# EAGLE design TriacFanout (EAGLE 6.5.0)
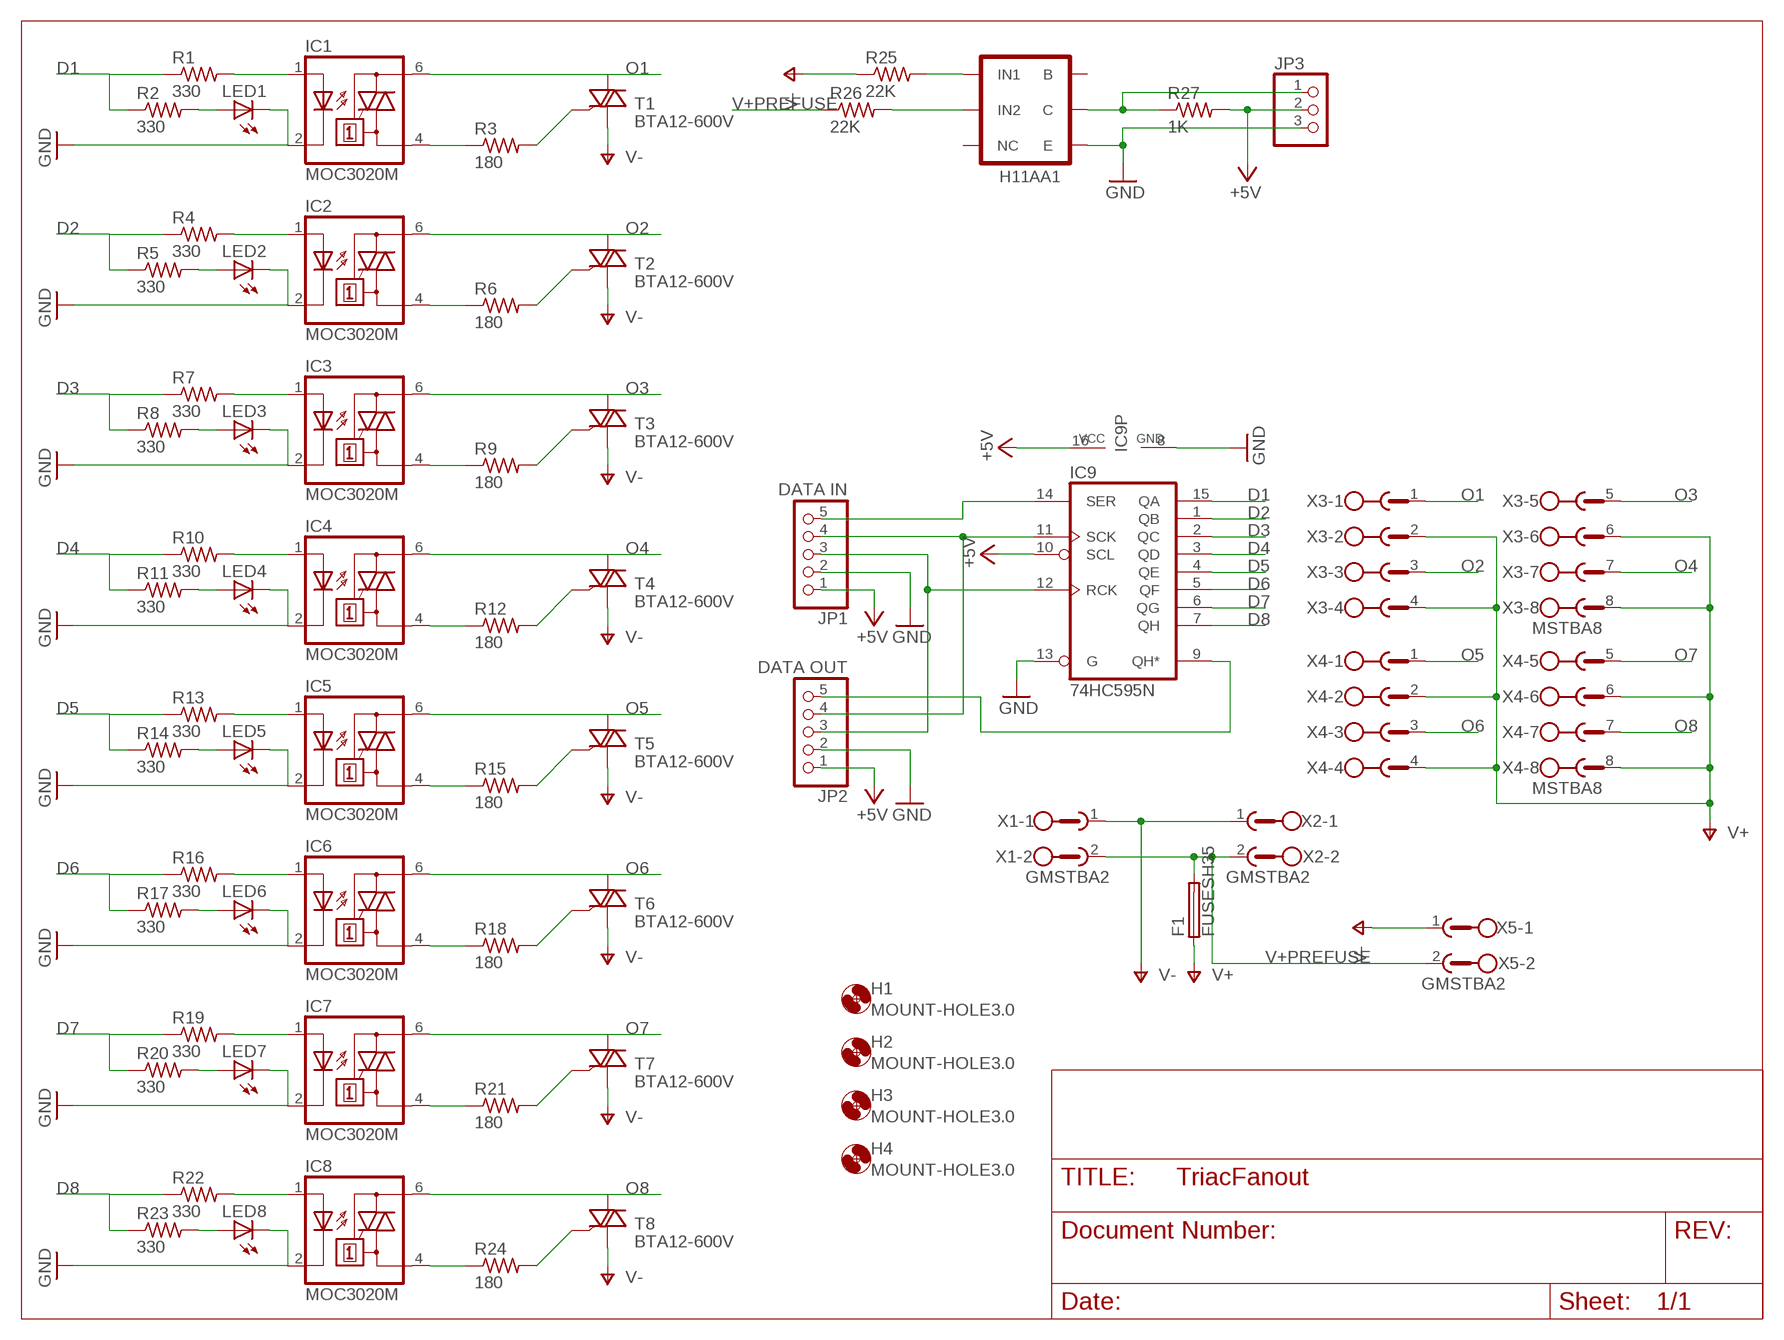
[diagram p0: schematic, sheet 1]

## Parts
F1  FUSESH35  [SH25]
H1  MOUNT-HOLE3.0  [3,0]
H2  MOUNT-HOLE3.0  [3,0]
H3  MOUNT-HOLE3.0  [3,0]
H4  MOUNT-HOLE3.0  [3,0]
IC1  MOC3020M  [DIL06]
IC2  MOC3020M  [DIL06]
IC3  MOC3020M  [DIL06]
IC4  MOC3020M  [DIL06]
IC5  MOC3020M  [DIL06]
IC6  MOC3020M  [DIL06]
IC7  MOC3020M  [DIL06]
IC8  MOC3020M  [DIL06]
IC9  74HC595N  [DIL16]
JP1  DATA IN  PINHD-1X5  [1X05]
JP2  DATA OUT  PINHD-1X5  [1X05]
JP3  PINHD-1X3  [1X03]
LED1  LED5MM  [LED5MM]
LED2  LED5MM  [LED5MM]
LED3  LED5MM  [LED5MM]
LED4  LED5MM  [LED5MM]
LED5  LED5MM  [LED5MM]
LED6  LED5MM  [LED5MM]
LED7  LED5MM  [LED5MM]
LED8  LED5MM  [LED5MM]
R1  330  R-US_0207/10  [0207/10]
R2  330  R-US_0207/10  [0207/10]
R3  180  R-US_0207/10  [0207/10]
R4  330  R-US_0207/10  [0207/10]
R5  330  R-US_0207/10  [0207/10]
R6  180  R-US_0207/10  [0207/10]
R7  330  R-US_0207/10  [0207/10]
R8  330  R-US_0207/10  [0207/10]
R9  180  R-US_0207/10  [0207/10]
R10  330  R-US_0207/10  [0207/10]
R11  330  R-US_0207/10  [0207/10]
R12  180  R-US_0207/10  [0207/10]
R13  330  R-US_0207/10  [0207/10]
R14  330  R-US_0207/10  [0207/10]
R15  180  R-US_0207/10  [0207/10]
R16  330  R-US_0207/10  [0207/10]
R17  330  R-US_0207/10  [0207/10]
R18  180  R-US_0207/10  [0207/10]
R19  330  R-US_0207/10  [0207/10]
R20  330  R-US_0207/10  [0207/10]
R21  180  R-US_0207/10  [0207/10]
R22  330  R-US_0207/10  [0207/10]
R23  330  R-US_0207/10  [0207/10]
R24  180  R-US_0207/10  [0207/10]
R25  22K  R-US_0411/12  [0411/12]
R26  22K  R-US_0411/12  [0411/12]
R27  1K  R-US_0207/10  [0207/10]
T1  BTA12-600V  [TO220V]
T2  BTA12-600V  [TO220V]
T3  BTA12-600V  [TO220V]
T4  BTA12-600V  [TO220V]
T5  BTA12-600V  [TO220V]
T6  BTA12-600V  [TO220V]
T7  BTA12-600V  [TO220V]
T8  BTA12-600V  [TO220V]
U$1  H11AA1  [DIL06]
X1  GMSTBA2  [GMSTBA2]
X2  GMSTBA2  [GMSTBA2]
X3  MSTBA8  [MSTBA8]
X4  MSTBA8  [MSTBA8]
X5  GMSTBA2  [GMSTBA2]

## Nets
+5V: IC9.10(SCL) IC9.16(VCC) JP1.1 JP2.1 JP3.2 R27.2
CLOCK: IC9.11(SCK) JP1.4 JP2.4
D1: IC9.15(QA) R1.1 R2.1
D2: IC9.1(QB) R4.1 R5.1
D3: IC9.2(QC) R7.1 R8.1
D4: IC9.3(QD) R10.1 R11.1
D5: IC9.4(QE) R13.1 R14.1
D6: IC9.5(QF) R16.1 R17.1
D7: IC9.6(QG) R19.1 R20.1
D8: IC9.7(QH) R22.1 R23.1
DATA: IC9.14(SER) JP1.5
GND: IC1.2(C) IC2.2(C) IC3.2(C) IC4.2(C) IC5.2(C) IC6.2(C) IC7.2(C) IC8.2(C) IC9.8(GND) IC9.13(G) JP1.2 JP2.2 JP3.3 LED1.K(C) LED2.K(C) LED3.K(C) LED4.K(C) LED5.K(C) LED6.K(C) LED7.K(C) LED8.K(C) U$1.4(E)
LATCH: IC9.12(RCK) JP1.3 JP2.3
N$1: IC2.1(A) R4.2
N$2: LED2.A R5.2
N$3: IC2.4(A1) R6.1
N$4: R6.2 T2.3(G)
N$5: IC3.1(A) R7.2
N$6: LED3.A R8.2
N$7: IC3.4(A1) R9.1
N$8: R9.2 T3.3(G)
N$9: IC1.4(A1) R3.1
N$10: IC1.1(A) R1.2
N$11: R3.2 T1.3(G)
N$12: LED1.A R2.2
N$13: IC4.1(A) R10.2
N$14: LED4.A R11.2
N$15: IC4.4(A1) R12.1
N$16: R12.2 T4.3(G)
N$17: IC5.1(A) R13.2
N$18: LED5.A R14.2
N$19: IC5.4(A1) R15.1
N$20: R15.2 T5.3(G)
N$21: IC6.1(A) R16.2
N$22: LED6.A R17.2
N$23: IC6.4(A1) R18.1
N$24: R18.2 T6.3(G)
N$25: IC7.1(A) R19.2
N$26: LED7.A R20.2
N$27: IC7.4(A1) R21.1
N$28: R21.2 T7.3(G)
N$29: IC8.1(A) R22.2
N$30: LED8.A R23.2
N$31: IC8.4(A1) R24.1
N$32: R24.2 T8.3(G)
N$34: R25.2 U$1.1(IN1)
N$40: R26.2 U$1.2(IN2)
O1: IC1.6(A2) T1.2(A2) X3.1
O2: IC2.6(A2) T2.2(A2) X3.3
O3: IC3.6(A2) T3.2(A2) X3.5
O4: IC4.6(A2) T4.2(A2) X3.7
O5: IC5.6(A2) T5.2(A2) X4.1
O6: IC6.6(A2) T6.2(A2) X4.3
O7: IC7.6(A2) T7.2(A2) X4.5
O8: IC8.6(A2) T8.2(A2) X4.7
OVERFLOW: IC9.9(QH*) JP2.5
V+: F1.1 X3.2 X3.4 X3.6 X3.8 X4.2 X4.4 X4.6 X4.8
V+PREFUSE: F1.2 R26.1 X1.2 X2.2 X5.2
V-: R25.1 T1.1(A1) T2.1(A1) T3.1(A1) T4.1(A1) T5.1(A1) T6.1(A1) T7.1(A1) T8.1(A1) X1.1 X2.1 X5.1
ZEROCROSS: JP3.1 R27.1 U$1.5(C)
Unconnected: U$1.3(NC) U$1.6(B)

## Library data of the parts
F1 = fuse:FUSE: Fuse; OC_FARNELL: unknown; OC_NEWARK: unknown
H1-H4 = holes:MOUNT-HOLE: MOUNTING HOLE with drill center marker
IC1-IC8 = optocoupler:MOC30*M: RANDOM-PHASE OPTOISOLATORS TRIAC DRIVER OUTPUT Source: http://www.fairchildsemi.com MOC3020-M.pdf; MF: FAIRCHILD SEMICONDUCTOR; MPN: MOC3020-M; OC_FARNELL: 1505425; OC_NEWARK: 72K8895
IC9 = 74xx-eu:74*595: 8-bit SHIFT REGISTER, output latch
JP1 JP2 = pinhead:PINHD-1X5: PIN HEADER
JP3 = pinhead:PINHD-1X3: PIN HEADER
LED1-LED8 = adafruit:LED: LED OSRAM: - CHIPLED LG R971, LG N971, LY N971, LG Q971, LY Q971, LO R971, LY R971 LH N974, LH R974 LS Q976, LO Q976, LY Q976 LO Q996 - Hyper CHIPLED LW Q18S LB Q993, LB Q99A, LB R99A - SideLED LS A670, LO A670, LY A670, LG A670, LP A670 LB A673, LV A673, LT A673, LW A673 LH A674 LY A675 LS A676, LA A676, LO A676, LY A676, LW A676 LS A679, LY A679, LG A679 - Hyper Micro SIDELED® LS Y876, LA Y876, LO Y876, LY Y876 LT Y87S - SmartLED LW L88C, LW L88S LB L89C, LB L89S, LG L890 LS L89K, LO L89K, LY L89K LS L896, LA L896, LO L896, LY L896 - TOPLED LS T670, LO T670, LY T670, LG T670, LP T670 LSG T670, LSP T670, LSY T670, LOP T670, LYG T670 LG T671, LOG T671, LSG T671 LB T673, LV T673, LT T673, LW T673 LH T674 LS T676, LA T676, LO T676, LY T676, LB T676, LH T676, LSB T676, LW T676 LB T67C, LV T67C, LT T67C, LS T67K, LO T67K, LY T67K, LW E67C LS E67B, LA E67B, LO E67B, LY E67B, LB E67C, LV E67C, LT E67C LW T67C LS T679, LY T679, LG T679 LS T770, LO T770, LY T770, LG T770, LP T770 LB T773, LV T773, LT T773, LW T773 LH T774 LS E675, LA E675, LY E675, LS T675 LS T776, LA T776, LO T776, LY T776, LB T776 LHGB T686 LT T68C, LB T68C - Hyper Mini TOPLED® LB M676 - Mini TOPLED Santana® LG M470 LS M47K, LO M47K, LY M47K Source: http://www.osram.convergy.de/
R1-R27 = adafruit:R-US_: RESISTOR, American symbol
T1-T8 = twomey:BTA12-600: Thyristor TRIAC 600 Volt 126A 3-Pin (3+Tab) TO-220AB Isolated Tube Source: http://www.jameco.com/Jameco/Products/ProdDS/2034010.pdf
U$1 = boxysean:H11AA1
X1 X2 X5 = con-phoenix-762:GMSTBA2: PHOENIX; MF: FARNELL; MPN: 1757242; OC_FARNELL: 3705171; OC_NEWARK: 71C4161
X3 X4 = con-phoenix-508:MSTBA8: PHOENIX; MF: FARNELL; MPN: 1757307; OC_FARNELL: 3705225; OC_NEWARK: 71C4166

## Board
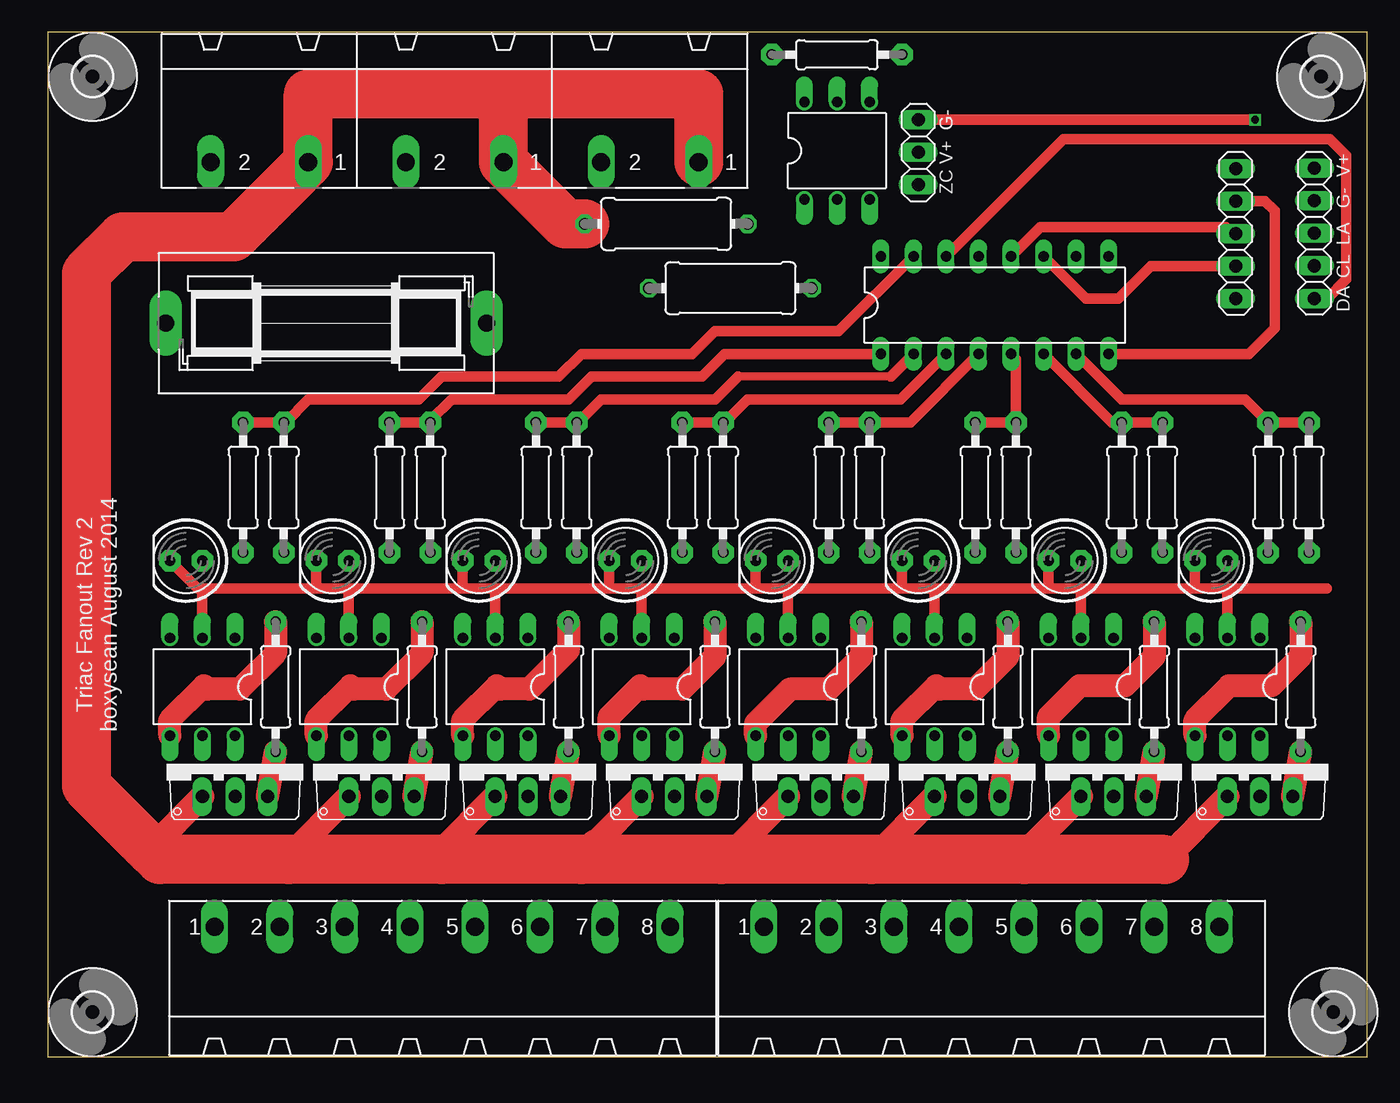
[diagram p1: board, top side]
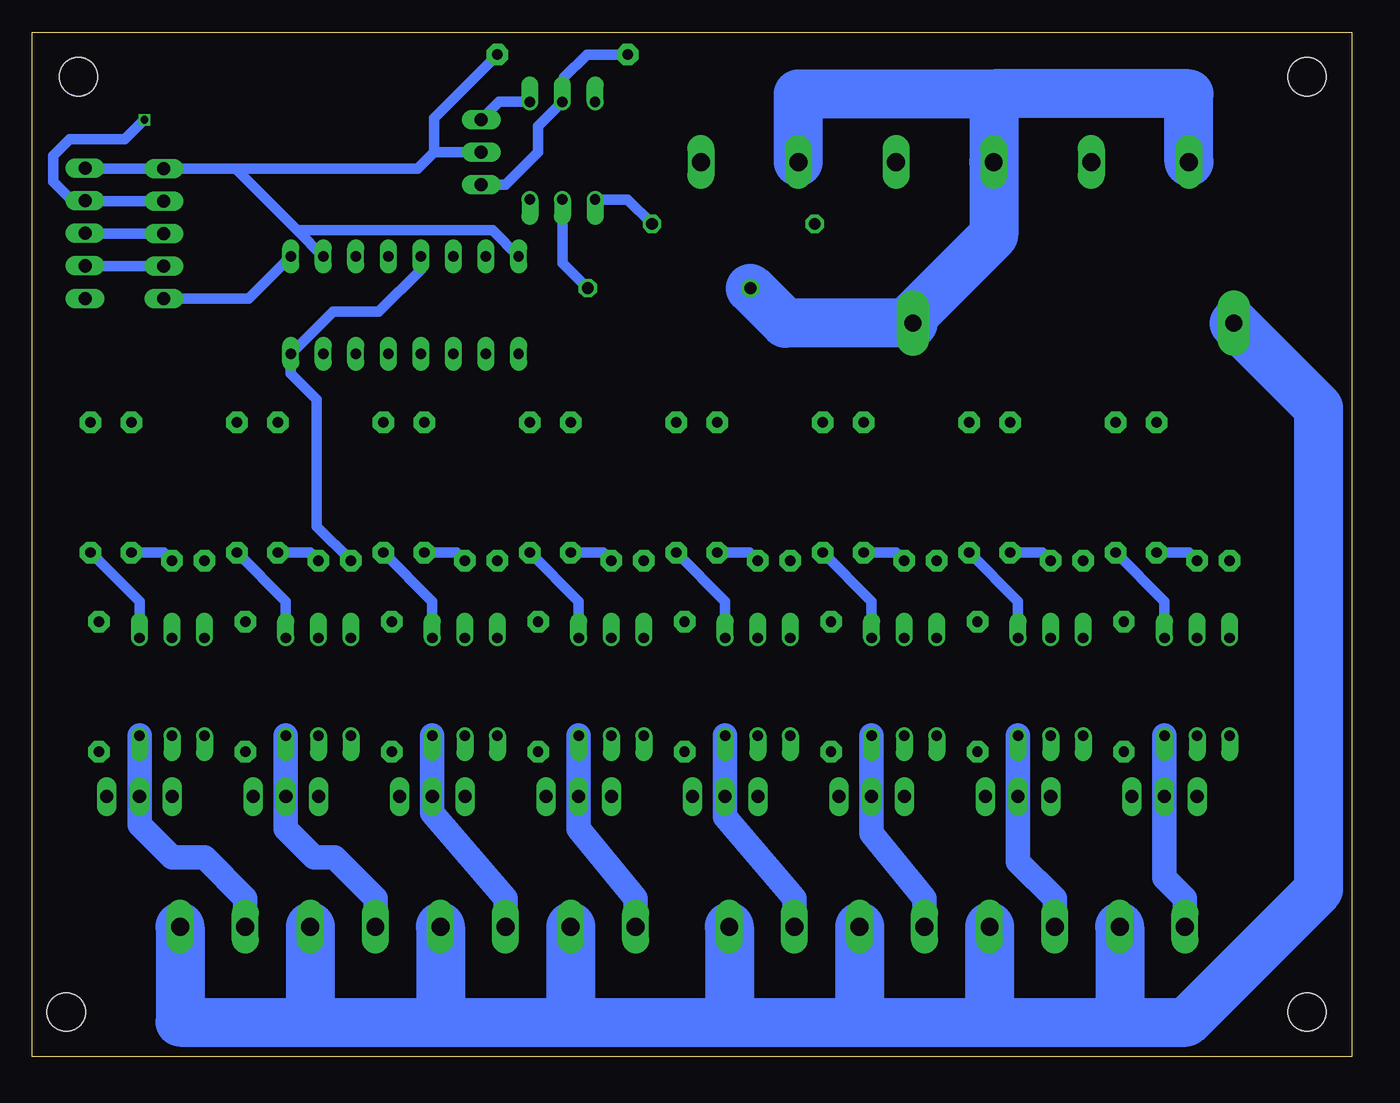
[diagram p2: board, bottom side, seen from below]

Size 103 x 80 mm. Coordinates in mm from the lower left corner, seen from the top.
Outline: 0,0 103,0 103,80 0,80 0,0
Copper layers (1*16): Top 0.035mm / dielectric 1.5mm / Bottom 0.035mm
Design rules "dirt_cheap_dirty_boards.v1": minimum track width 5mil, minimum drill 12mil, track to track 5mil, track to pad 5mil, pad to pad 5mil, via to via 5mil, smd to smd 0mil, copper to edge 10mil, drill to drill 10mil, minimum pad ring 10mil, minimum via ring 6mil, stop-mask expansion 2mil, vias tented up to drill 25mil, thermal gap 10mil

### Footprints (pad centres in the part's own frame; a part is rotated, then mirrored left to right if it is on the bottom)
SH25 = drill 1.321 pad 2.54 long: 1 -12.522,0; 2 12.522,0
3,0 = hole 3: 0,0
DIL06 = drill 0.813 offset: 1 -2.54,-3.81; 2 0,-3.81; 3 2.54,-3.81; 4 2.54,3.81; 5 0,3.81; 6 -2.54,3.81
DIL16 = drill 0.813 long: 1 -8.89,-3.81; 2 -6.35,-3.81; 3 -3.81,-3.81; 4 -1.27,-3.81; 5 1.27,-3.81; 6 3.81,-3.81; 7 6.35,-3.81; 8 8.89,-3.81; 9 8.89,3.81; 10 6.35,3.81; 11 3.81,3.81; 12 1.27,3.81; 13 -1.27,3.81; 14 -3.81,3.81; 15 -6.35,3.81; 16 -8.89,3.81
1X05 = drill 1.016 long: 1 -5.08,0; 2 -2.54,0; 3 0,0; 4 2.54,0; 5 5.08,0
1X03 = drill 1.016 long: 1 -2.54,0; 2 0,0; 3 2.54,0
LED5MM = drill 0.813 pad 1.676 octagon: A -1.27,0; K 1.27,0
0207/10 = drill 0.813 pad 1.676 octagon: 1 -5.08,0; 2 5.08,0
0411/12 = drill 0.914 octagon: 1 -6.35,0; 2 6.35,0
TO220V = drill 1.016 long: 1 -2.54,-2.54; 2 0,-2.54; 3 2.54,-2.54
GMSTBA2 = drill 1.397 long: 1 -3.81,5.08; 2 3.81,5.08
MSTBA8 = drill 1.397 long: 1 -17.78,5.08; 2 -12.7,5.08; 3 -7.62,5.08; 4 -2.54,5.08; 5 2.54,5.08; 6 7.62,5.08; 7 12.7,5.08; 8 17.78,5.08

### Placement (x,y rotation side)
F1  21.72,57.28 0 top
H1  3.49,3.49 0 top
H2  99.38,76.52 0 top
H3  100.33,3.49 0 top
H4  3.49,76.52 0 top
IC1  12.06,28.89 180 top
IC2  23.5,28.89 180 top
IC3  34.92,28.89 180 top
IC4  46.35,28.89 180 top
IC5  57.78,28.89 180 top
IC6  69.22,28.89 180 top
IC7  80.64,28.89 180 top
IC8  92.08,28.89 180 top
IC9  73.91,58.67 0 top
JP1  98.86,64.29 270 top
JP2  92.71,64.26 270 top
JP3  67.94,70.61 90 top
LED1  10.79,38.73 180 top
LED2  22.23,38.73 180 top
LED3  33.66,38.73 180 top
LED4  45.09,38.73 180 top
LED5  56.52,38.73 180 top
LED6  67.94,38.73 180 top
LED7  79.38,38.73 180 top
LED8  90.81,38.73 180 top
R1  18.41,44.45 270 top
R2  15.24,44.45 270 top
R3  17.78,28.89 270 top
R4  29.84,44.45 270 top
R5  26.67,44.45 270 top
R6  29.21,28.89 270 top
R7  41.27,44.45 270 top
R8  38.1,44.45 270 top
R9  40.64,28.89 270 top
R10  52.7,44.45 270 top
R11  49.53,44.45 270 top
R12  52.07,28.89 270 top
R13  64.14,44.45 270 top
R14  60.96,44.45 270 top
R15  63.5,28.89 270 top
R16  75.56,44.45 270 top
R17  72.39,44.45 270 top
R18  74.93,28.89 270 top
R19  87,44.45 270 top
R20  83.82,44.45 270 top
R21  86.36,28.89 270 top
R22  98.42,44.45 270 top
R23  95.25,44.45 270 top
R24  97.79,28.89 270 top
R25  48.26,65.02 0 top
R26  53.28,60.01 0 top
R27  61.59,78.23 0 top
T1  14.61,22.86 0 top
T2  26.04,22.86 0 top
T3  37.47,22.86 0 top
T4  48.9,22.86 0 top
T5  60.33,22.86 0 top
T6  71.75,22.86 0 top
T7  83.19,22.86 0 top
T8  94.61,22.86 0 top
U$1  61.59,70.74 0 top
X1  16.51,74.93 180 top
X2  31.75,74.93 180 top
X3  30.8,5.08 0 top
X4  73.66,5.08 0 top
X5  46.99,74.93 180 top

### Tracks (layer width: path | path; a pad name or v marks a point on that pad's centre or on a via)
+5V
  Bottom 0.813: JP1.1 98.83,69.34 JP2.1 87.12,69.34 | 87.12,69.34 82.3,64.52 | 82.3,64.52 IC9.10 | IC9.16 67.06,64.52 82.3,64.52 | JP3.2 71.63,70.61 | 71.63,70.61 72.9,69.34 87.12,69.34 | R27.2 71.63,73.28 71.63,70.61
CLOCK
  Top 0.813: JP2.4 86.11,61.72 83.57,59.18 81.03,59.18 IC9.11
  Bottom 0.813: JP1.4 98.83,61.72 JP2.4
D1
  Top 0.813: R2.1 R1.1 18.54,49.53 20.32,51.31 28.96,51.31 30.73,53.09 39.88,53.09 41.66,54.86 50.29,54.86 52.07,56.64 61.72,56.64 IC9.15
D2
  Top 0.813: R5.1 R4.1 29.84,49.66 31.5,51.31 40.64,51.31 42.42,53.09 51.05,53.09 52.83,54.86 IC9.1
D3
  Top 0.61: 65.79,53.09 53.85,53.09
  Top 0.813: R8.1 R7.1 41.4,49.53 43.18,51.31 52.07,51.31 53.85,53.09 | IC9.2 65.79,53.09
D4
  Top 0.813: R11.1 R10.1 52.83,49.53 54.61,51.31 66.55,51.31 IC9.3
D5
  Top 0.813: R14.1 R13.1 67.31,49.53 IC9.4
D6
  Top 0.813: R17.1 R16.1 75.56,54.48 IC9.5
D7
  Top 0.813: R19.1 R20.1 83.06,49.53 IC9.6
D8
  Top 0.813: R22.1 R23.1 93.47,51.31 83.82,51.31 IC9.7
DATA
  Top 0.813: IC9.14 79.25,71.63 100.08,71.63 101.35,70.36 101.35,60.71 99.85,59.21 JP1.5
GND  (via drill 0.6)
  Top 0.813: LED1.K 11.68,36.58 12.06,36.58 | 12.06,36.58 20.95,36.58 | 20.95,36.58 23.5,36.58 | 23.5,36.58 32.38,36.58 | 32.38,36.58 34.92,36.58 | 34.92,36.58 43.81,36.58 | 43.81,36.58 46.35,36.58 | 46.35,36.58 55.24,36.58 | 55.24,36.58 57.78,36.58 | 57.78,36.58 66.67,36.58 | 66.67,36.58 69.22,36.58 | 69.22,36.58 78.11,36.58 | 78.11,36.58 80.64,36.58 | 80.64,36.58 89.53,36.58 | 89.53,36.58 92.08,36.58 | 92.08,36.58 99.82,36.58 | IC1.2 12.06,36.58 | LED2.K 20.95,36.58 | IC2.2 23.5,36.58 | LED3.K 32.38,36.58 | IC3.2 34.92,36.58 | LED4.K 43.81,36.58 | IC4.2 46.35,36.58 | LED5.K 55.24,36.58 | IC5.2 57.78,36.58 | LED6.K 66.67,36.58 | IC6.2 69.22,36.58 | LED7.K 78.11,36.58 | IC7.2 80.64,36.58 | LED8.K 89.53,36.58 | IC8.2 92.08,36.58 | JP2.2 95,66.8 95.76,66.04 95.76,56.9 93.73,54.86 IC9.8 | JP3.3 v94.23,73.15
  Bottom 0.813: LED7.K 80.77,41.4 80.77,51.31 82.8,53.34 IC9.8 79.5,58.17 75.95,58.17 72.64,61.47 IC9.13 | JP2.2 98.83,66.8 JP1.2 99.85,66.83 101.35,68.33 101.35,70.36 100.08,71.63 95.76,71.63 v94.23,73.15 | JP3.3 66.55,74.55 U$1.4
LATCH
  Top 0.813: JP2.3 92.46,64.26 91.95,64.77 77.47,64.77 IC9.12
  Bottom 0.813: JP1.3 98.83,64.26 JP2.3
N$1
  Bottom 0.813: R4.2 26.04,35.56 IC2.1
N$2
  Bottom 0.813: R5.2 24.13,39.37 LED2.A
N$3
  Top 1.778: IC2.4 20.95,26.29 23.62,28.96 23.88,28.7 26.42,28.7 29.21,31.5 R6.1
N$4
  Top 1.778: T2.3 R6.2
N$5
  Bottom 0.813: R7.2 37.47,35.56 IC3.1
N$6
  Bottom 0.813: R8.2 35.56,39.37 LED3.A
N$7
  Top 1.778: IC3.4 32.38,26.29 35.05,28.96 35.31,28.7 37.59,28.7 40.64,31.75 R9.1
N$8
  Top 1.778: T3.3 R9.2
N$9
  Top 1.778: IC1.4 9.53,26.29 12.19,28.96 12.45,28.7 14.99,28.7 17.78,31.5 R3.1
N$10
  Bottom 0.813: R1.2 14.61,35.56 IC1.1
N$11
  Top 1.778: T1.3 R3.2
N$12
  Bottom 0.813: R2.2 12.7,39.37 LED1.A
N$13
  Bottom 0.813: R10.2 48.9,35.56 IC4.1
N$14
  Bottom 0.813: R11.2 46.99,39.37 LED4.A
N$15
  Top 1.778: IC4.4 43.81,26.54 46.23,28.96 46.48,28.7 49.53,28.7 52.07,31.24 R12.1
N$16
  Top 1.778: T4.3 R12.2
N$17
  Bottom 0.813: R13.2 60.33,35.56 IC5.1
N$18
  Bottom 0.813: LED5.A 58.42,39.37 R14.2
N$19
  Top 1.778: IC5.4 55.24,26.04 57.53,28.32 57.91,28.7 60.96,28.7 63.5,31.24 R15.1
N$20
  Top 1.778: T5.3 R15.2
N$21
  Bottom 0.813: R16.2 71.75,35.56 IC6.1
N$22
  Bottom 0.813: LED6.A 69.85,39.37 R17.2
N$23
  Top 1.778: IC6.4 66.67,26.29 69.34,28.96 69.6,28.7 72.39,28.7 74.93,31.24 R18.1
N$24
  Top 1.778: T6.3 R18.2
N$25
  Bottom 0.813: R19.2 83.19,35.56 IC7.1
N$26
  Bottom 0.813: LED7.A 81.28,39.37 R20.2
N$27
  Top 1.778: IC7.4 78.11,26.54 80.14,28.57 80.52,28.96 84.07,28.96 86.36,31.24 R21.1
N$28
  Top 1.778: T7.3 R21.2
N$29
  Bottom 0.813: R22.2 94.61,35.56 IC8.1
N$30
  Bottom 0.813: LED8.A 92.71,39.37 R23.2
N$31
  Top 1.778: IC8.4 89.53,26.29 92.2,28.96 95.5,28.96 97.79,31.24 R24.1
N$32
  Top 1.778: T8.3 R24.2
N$34
  Bottom 0.813: R25.2 56.52,66.93 U$1.1
N$40
  Bottom 0.813: U$1.2 61.59,61.98 R26.2
O1
  Bottom 1.93: IC1.6 T1.2 14.61,13.97 13.02,12.38 X3.1
O2
  Bottom 1.93: IC2.6 T2.2 26.04,15.24 23.18,12.38 X3.3
O3
  Bottom 1.93: IC3.6 T3.2 37.47,17.46 33.34,12.38 X3.5
O4
  Bottom 1.93: IC4.6 T4.2 48.9,18.73 43.5,12.38 X3.7
O5
  Bottom 1.93: IC5.6 T5.2 60.33,17.78 55.88,12.38 X4.1
O6
  Bottom 1.93: IC6.6 T6.2 71.75,19.05 66.04,12.38 X4.3
O7
  Bottom 1.93: IC7.6 T7.2 83.19,19.81 83.19,18.73 83.19,17.78 80.96,15.56 79.38,15.56 76.2,12.38 X4.5
O8
  Bottom 1.93: IC8.6 T8.2 | X4.7 86.36,12.38 89.53,15.56 92.08,15.56 94.61,18.1 T8.2 | 94.61,19.05 T8.2
OVERFLOW
  Bottom 0.813: JP2.5 86.11,59.18 IC9.9
V+
  Bottom 3.81: 81.28,2.72 91.44,2.72 X4.8 | 81.28,2.72 71.12,2.72 | 71.12,2.72 60.96,2.72 | 60.96,2.72 48.58,2.72 | 48.58,2.72 38.42,2.72 | 38.42,2.72 28.26,2.72 | 28.26,2.72 18.1,2.72 | 18.1,2.72 12.91,2.72 2.58,13.05 2.58,50.66 F1.1 | X4.6 81.28,2.72 | X4.4 71.12,2.72 | X4.2 60.96,2.72 | X3.8 48.58,2.72 | X3.6 38.42,2.72 | X3.4 28.26,2.72 | X3.2 18.1,2.72
V+PREFUSE
  Bottom 3.81: X1.2 12.7,75.18 27.94,75.18 | 27.94,75.18 X2.2 27.94,64.14 34.8,57.28 | F1.2 34.8,57.28 | 34.8,57.28 44.2,57.28 R26.1 | X5.2 43.18,75.18 27.94,75.18
V-
  Top 1.93: T1.1 8.15,16.41 | T2.1 18.8,15.62 | T3.1 30.73,16.13 | T4.1 42.67,16.64 | T5.1 52.88,15.41 | T6.1 64.31,15.41 | T7.1 76.2,15.88 | T8.1 87.17,15.41
  Top 2.184: 8.15,16.41 7.77,16.41 | 18.8,15.62 18.8,15.41 | 30.73,16.13 30.73,15.41 | 42.67,16.64 42.67,16 42.09,15.41 41.66,15.41 | 52.88,15.41 52.58,15.41 | 64.31,15.41 64.26,15.41 | 76.2,15.88 76.2,15.41
  Top 3.81: 87.17,15.41 76.2,15.41 64.26,15.41 52.58,15.41 41.66,15.41 30.73,15.41 18.8,15.41 8.76,15.41 7.77,16.41 3,21.17 3,61.17 5.84,64.01 14.48,64.01 X1.1 20.32,75.18 35.56,75.18 | 35.56,75.18 50.8,75.18 X5.1 | 35.56,75.18 X2.1 40.39,65.02 R25.1
ZEROCROSS
  Bottom 0.813: JP3.1 66.04,68.07 63.5,70.61 63.5,72.64 U$1.5 61.47,74.68 61.47,76.45 59.69,78.23 R27.1

### Text on the board
tNames: G- | G- | V+ | V+ | ZC | G- | LA | CL | DA | Triac Fanout Rev 2 / boxysean August 2014
tValues: A1 | A2 | A1 | A2 | A1 | A2 | A1 | A1 | MOC3020 | MOC3020 | MOC3020 | MOC3020 | MOC3020 | MOC3020 | MOC3020 | MOC3020 | 1 | A1 | 2 | A1 | 3 | A1 | 4 | A1 | 5 | A1 | 6 | A1 | 7 | A1 | 8 | A1 | ~ | ~ | ~ | ~ | ~ | ~ | ~ | ~